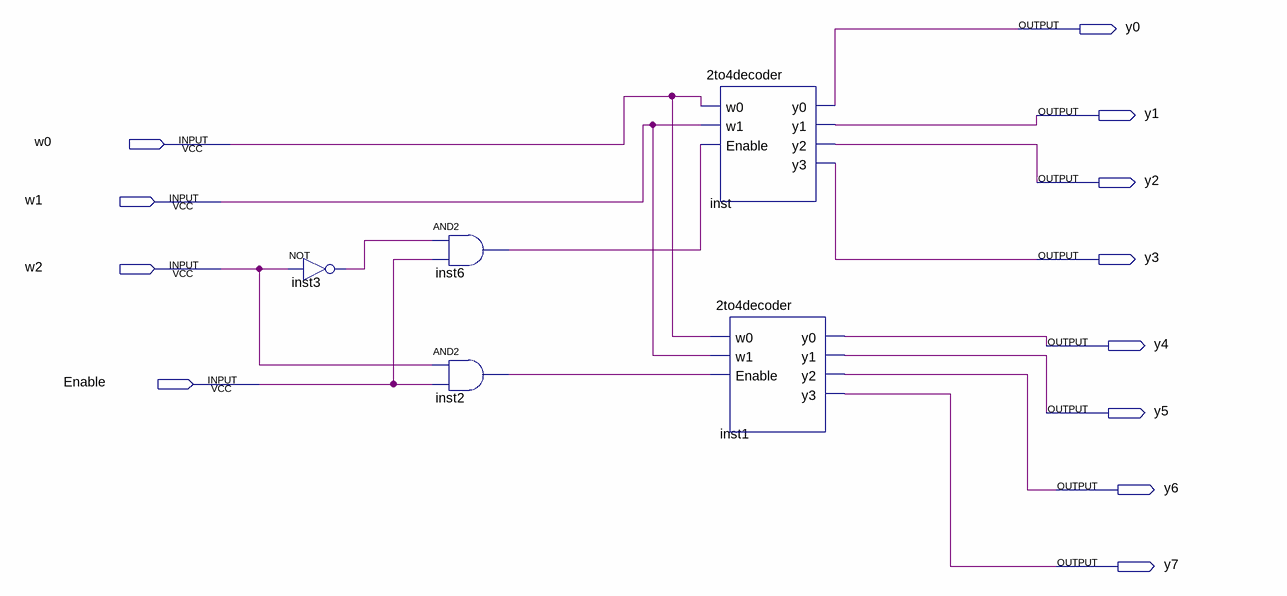
[diagram p0: schematic sheet]
// Quartus schematic 3to8decoder.bdf as structural Verilog: 5 symbols, 12 pins
module \3to8decoder  (
  input  w0,
  input  w1,
  input  w2,
  input  Enable,
  output y0,
  output y1,
  output y2,
  output y3,
  output y4,
  output y5,
  output y6,
  output y7
);

  wire inst2_out, inst3_out, inst6_out;

  not inst3 (inst3_out, w2);
  and inst6 (inst6_out, inst3_out, Enable);
  and inst2 (inst2_out, w2, Enable);
  \2to4decoder  inst (.w0(w0), .w1(w1), .Enable(inst6_out), .y0(y0), .y1(y1), .y2(y2), .y3(y3));
  \2to4decoder  inst1 (.w0(w0), .w1(w1), .Enable(inst2_out), .y0(y4), .y1(y5), .y2(y6), .y3(y7));
endmodule
